# Altium schematic sheet mcu.SchDoc
size A4
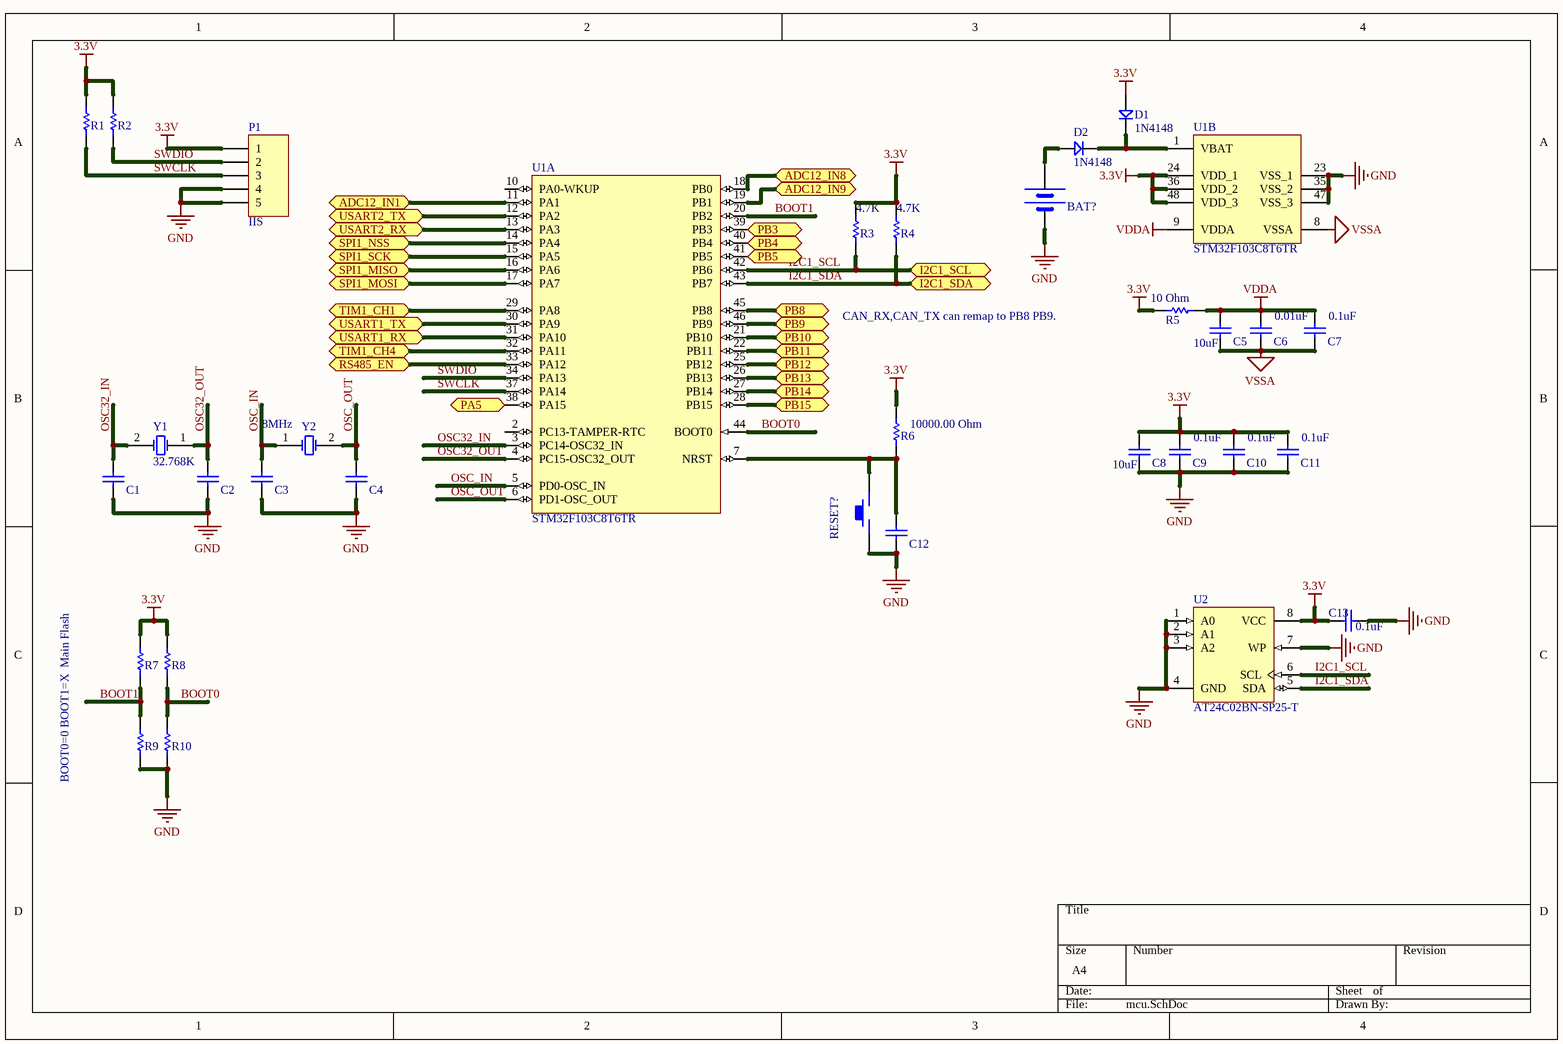
[diagram p0: mcu.SchDoc]

## Parts
BAT?  BATT  [BATM]  (value not drawn)
C1  CAP 22pF 50V 0805(2012)  [CAPC0805(2012)75_M]  (value not drawn)
C2  CAP 22pF 50V 0805(2012)  [CAPC0805(2012)75_M]  (value not drawn)
C3  CAP 22pF 50V 0805(2012)  [CAPC0805(2012)75_M]  (value not drawn)
C4  CAP 22pF 50V 0805(2012)  [CAPC0805(2012)75_M]  (value not drawn)
C5  value 10uF  [CAPC1210(3225)170_N]  (hidden comment: CAP 10uF 10V 1210(3225))
C6  value 0.01uF  [CAPC0805(2012)100_N]  (hidden comment: CAP 0.01uF 50V 0805(2012))
C7  value 0.1uF  [CAPC0805(2012)100_N]  (hidden comment: CAP 0.1uF 50V 0805(2012))
C8  value 10uF  [CAPC1210(3225)170_N]  (hidden comment: CAP 10uF 10V 1210(3225))
C9  value 0.1uF  [CAPC0805(2012)100_N]  (hidden comment: CAP 0.1uF 50V 0805(2012))
C10  value 0.1uF  [CAPC0805(2012)100_N]  (hidden comment: CAP 0.1uF 50V 0805(2012))
C11  value 0.1uF  [CAPC0805(2012)100_N]  (hidden comment: CAP 0.1uF 50V 0805(2012))
C12  CAP 0.1uF 50V 0805(2012)  [CAPC0805(2012)100_N]  (value not drawn)
C13  value 0.1uF  [CAPC0805(2012)100_N]  (hidden comment: CAP 0.1uF 50V 0805(2012))
D1  1N4148  [DIODE_SOP]
D2  1N4148  [DIODE_SOP]
P1  IIS  [HDR1X5]
R1  10K 5% 0805(2012)  [RESC0805(2012)_L]  (value not drawn)
R2  10K 5% 0805(2012)  [RESC0805(2012)_L]  (value not drawn)
R3  value 4.7K  [RESC0805(2012)_L]  (hidden comment: 4.7K 5% 0805(2012))
R4  value 4.7K  [RESC0805(2012)_L]  (hidden comment: 4.7K 5% 0805(2012))
R5  value 10 Ohm  [RESC0805(2012)_L]  (hidden comment: 10Ohm 5% 0805(2012))
R6  value 10000.00 Ohm  [RESC0805(2012)_L]  (hidden comment: 10K 5% 0805(2012))
R7  10K 5% 0805(2012)  [RESC0805(2012)_L]  (value not drawn)  (no BOM)
R8  10K 5% 0805(2012)  [RESC0805(2012)_L]  (value not drawn)  (no BOM)
R9  10K 5% 0805(2012)  [RESC0805(2012)_L]  (value not drawn)  (no BOM)
R10  10K 5% 0805(2012)  [RESC0805(2012)_L]  (value not drawn)
RESET?  KEY_M  [KEY_M]  (value not drawn)
U1  STM32F103C8T6TR  [STM-LQFP48_M]  (parts A,B of 2)
U2  AT24C02BN-SP25-T  [8S1_L]
Y1  32.768K  [XTAL32]
Y2  8MHz  [XTAL_US]

## Ports
ADC12_IN1, ADC12_IN8, ADC12_IN9, I2C1_SCL, I2C1_SDA, PA5, PB3, PB4, PB5, PB8, PB9, PB10, PB11, PB12, PB13, PB14, PB15, RS485_EN, SPI1_MISO, SPI1_MOSI, SPI1_NSS, SPI1_SCK, TIM1_CH1, TIM1_CH4, USART1_RX, USART1_TX, USART2_RX, USART2_TX

## Nets
3.3V: C8.2 C9.2 C10.2 C11.2 C13.2 D1.1 P1.1 R1.1 R2.1 R3.1 R4.1 R5.1 R6.1 R7.1 R8.1 U1.24(VDD_1) U1.36(VDD_2) U1.48(VDD_3) U2.8(VCC)
GND: BAT?.2(GND) C1.2 C2.1 C3.1 C4.1 C8.1 C9.1 C10.1 C11.1 C12.1 C13.1 P1.4 P1.5 R9.2 R10.2 RESET?.1 U1.23(VSS_1) U1.35(VSS_2) U1.47(VSS_3) U2.1(A0) U2.2(A1) U2.3(A2) U2.4(GND) U2.7(WP)
VDDA: C5.2 C6.2 C7.2 R5.2 U1.9(VDDA)
VSSA: C5.1 C6.1 C7.1 U1.8(VSSA)
ADC12_IN1: U1.11(PA1) ; port ADC12_IN1
ADC12_IN8: U1.18(PB0) ; port ADC12_IN8
ADC12_IN9: U1.19(PB1) ; port ADC12_IN9
BOOT0: R8.2 R10.1 U1.44(BOOT0)
BOOT1: R7.2 R9.1 U1.20(PB2)
I2C1_SCL: R3.2 U1.42(PB6) U2.6(SCL) ; port I2C1_SCL
I2C1_SDA: R4.2 U1.43(PB7) U2.5(SDA) ; port I2C1_SDA
OSC32_IN: C1.1 U1.3(PC14-OSC32_IN) Y1.2(OSC2)
OSC32_OUT: C2.2 U1.4(PC15-OSC32_OUT) Y1.1(OSC1)
OSC_IN: C3.2 U1.5(PD0-OSC_IN) Y2.1(OSC1)
OSC_OUT: C4.2 U1.6(PD1-OSC_OUT) Y2.2(OSC2)
PA5: U1.38(PA15) ; port PA5
PB3: U1.39(PB3) ; port PB3
PB4: U1.40(PB4) ; port PB4
PB5: U1.41(PB5) ; port PB5
PB8: U1.45(PB8) ; port PB8
PB9: U1.46(PB9) ; port PB9
PB10: U1.21(PB10) ; port PB10
PB11: U1.22(PB11) ; port PB11
PB12: U1.25(PB12) ; port PB12
PB13: U1.26(PB13) ; port PB13
PB14: U1.27(PB14) ; port PB14
PB15: U1.28(PB15) ; port PB15
RS485_EN: U1.33(PA12) ; port RS485_EN
SPI1_MISO: U1.16(PA6) ; port SPI1_MISO
SPI1_MOSI: U1.17(PA7) ; port SPI1_MOSI
SPI1_NSS: U1.14(PA4) ; port SPI1_NSS
SPI1_SCK: U1.15(PA5) ; port SPI1_SCK
SWCLK: P1.3 R1.2 U1.37(PA14)
SWDIO: P1.2 R2.2 U1.34(PA13)
TIM1_CH1: U1.29(PA8) ; port TIM1_CH1
TIM1_CH4: U1.32(PA11) ; port TIM1_CH4
USART1_RX: U1.31(PA10) ; port USART1_RX
USART1_TX: U1.30(PA9) ; port USART1_TX
USART2_RX: U1.13(PA3) ; port USART2_RX
USART2_TX: U1.12(PA2) ; port USART2_TX
NetBAT?_1: BAT?.1(VCC) D2.1
NetC12_2: C12.2 R6.2 RESET?.2 U1.7(NRST)
NetD1_2: D1.2 D2.2 U1.1(VBAT)

Not connected (* = marked no-connect by the designer): U1 2(PC13-TAMPER-RTC) 10(PA0-WKUP)

## Notes on the sheet
- CAN_RX,CAN_TX can remap to PB8 PB9.
- BOOT0=0 BOOT1=X  Main Flash

## Library data of the parts
BAT? = BAT
C1-C4 = CMP-1036-01234-1: CAP 22pF 50V ±1% 0805 (2012 Metric) Thickness 0.75mm SMD; Case-EIA: 0805; Case-Metric: 2012; Rated Voltage: 50 V; Value: 22pF; Tolerance: ±1%; Technology: SMT; Max Thickness: 0.75 mm
C5 C8 = CMP-1038-02199-1: CAP 10uF 10V ±20% 1210 (3225 Metric) Thickness 1.7mm SMD; Case-Metric: 3225; Case-EIA: 1210; Technology: SMT; Rated Voltage: 10 V; Tolerance: ±20%; Max Thickness: 1.7 mm
C6 C7 C9-C13 = CMP-1036-00070-1: CAP 0.1uF 50V ±20% 0805 (2012 Metric) Thickness 1mm SMD; Case-Metric: 2012; Case-EIA: 0805; Tolerance: 20%; Rated Voltage: 50 V; Technology: SMT; Max Thickness: 1 mm
  C12: Value: 0.1uF
D1 D2 = D
P1 = Header 5: Header, 5-Pin; LatestRevisionDate: 17-Jul-2002; LatestRevisionNote: Re-released for DXP Platform.; Publisher: Altium Limited
R1 R2 R7-R10 = CMP-1013-00098-1: 10K 0.125W 5% 0805 (2012 Metric)  SMD; Case-EIA: 0805; Case-Metric: 2012; Value: 10000.00 Ohm; Power: 0.125 W; Technology: SMT; Tolerance: 5 %
R3 R4 = CMP-1013-00098-1: 4.7K 0.125W 5% 0805 (2012 Metric)  SMD; Case-EIA: 0805; Case-Metric: 2012; Power: 0.125 W; Technology: SMT; Tolerance: 5 %
R5 = CMP-1013-00098-1: 10Ohm 0.125W 5% 0805 (2012 Metric)  SMD; Case-EIA: 0805; Case-Metric: 2012; Power: 0.125 W; Technology: SMT; Tolerance: 5 %
R6 = CMP-1013-00098-1: 10K 0.125W 5% 0805 (2012 Metric)  SMD; Case-EIA: 0805; Case-Metric: 2012; Power: 0.125 W; Technology: SMT; Tolerance: 5 %
U1 = CMP-0237-00216-3: ARM Cortex-M3 32-bit MCU, 64 KB Flash, 20 KB Internal RAM, 37 I/Os, 48-pin LQFP, -40 to 85 degC, Tape and Reel; A/D Converter: 2x12-bit (10 Channel); Internal RAM Size (kB): 20; Supply Voltage(Vcc) min (V): 2; I/Os (High Current): 37; FLASH Size (Prog) (kB): 64; Operating Frequency(F) (Processor speed) (MHz): 72; Packing: Tape and Reel; PackageReference: LQFP48; ComponentLink2Description: Datasheet; Core: ARM Cortex-M3; ComponentLink3URL: http://www.st.com/st-web-ui/static/active/en/resource/technical/document/datasheet/DM00058181.pdf; ComponentLink1Description: Manufacturer URL; ComponentLink3Description: Package Specification; PartNumber: STM32F103C8T6TR; PackageVersion: Rev. 6, 06/2013; ComponentLink2URL: http://www.st.com/st-web-ui/static/active/en/resource/technical/document/datasheet/CD00161566.pdf; PackageDescription: 48-Pin Low Profile Quad Flat Package, 7 x 7 mm Body, 0.5 mm Pitch; Mounting Technology: Surface Mount; DatasheetVersion: Rev. 16; ComponentLink1URL: http://www.st.com/web/en/home.html
U2 = CMP-0152-00023-1: 2Kbit (256 x 8), 2-wire Bus Automotive Serial EEPROM with full memory Write Protect, 2.5V, 8-Pin SOIC, Tape & Reel; PackageDescription: 8-Lead (0.150" Wide Body), Plastic Gull Wing Small Outline (JEDEC SOIC); Code_IPC: SOIC127P600-8; PackageReference: 8S1; DatasheetVersion: 8517C,  Jan-2009; Code_JEDEC: MS-012-AA; PackageVersion: revC, Mar-2005
Y1 = XTAL_1: Crystal Oscillator; Published: 8-Jun-2000; LatestRevisionDate: 17-Jul-2002; LatestRevisionNote: Re-released for DXP Platform.; Publisher: Altium Limited
Y2 = XTAL: Crystal Oscillator; Published: 8-Jun-2000; LatestRevisionDate: 17-Jul-2002; LatestRevisionNote: Re-released for DXP Platform.; Publisher: Altium Limited